# EAGLE design MSXIoT (EAGLE 9.6.2)
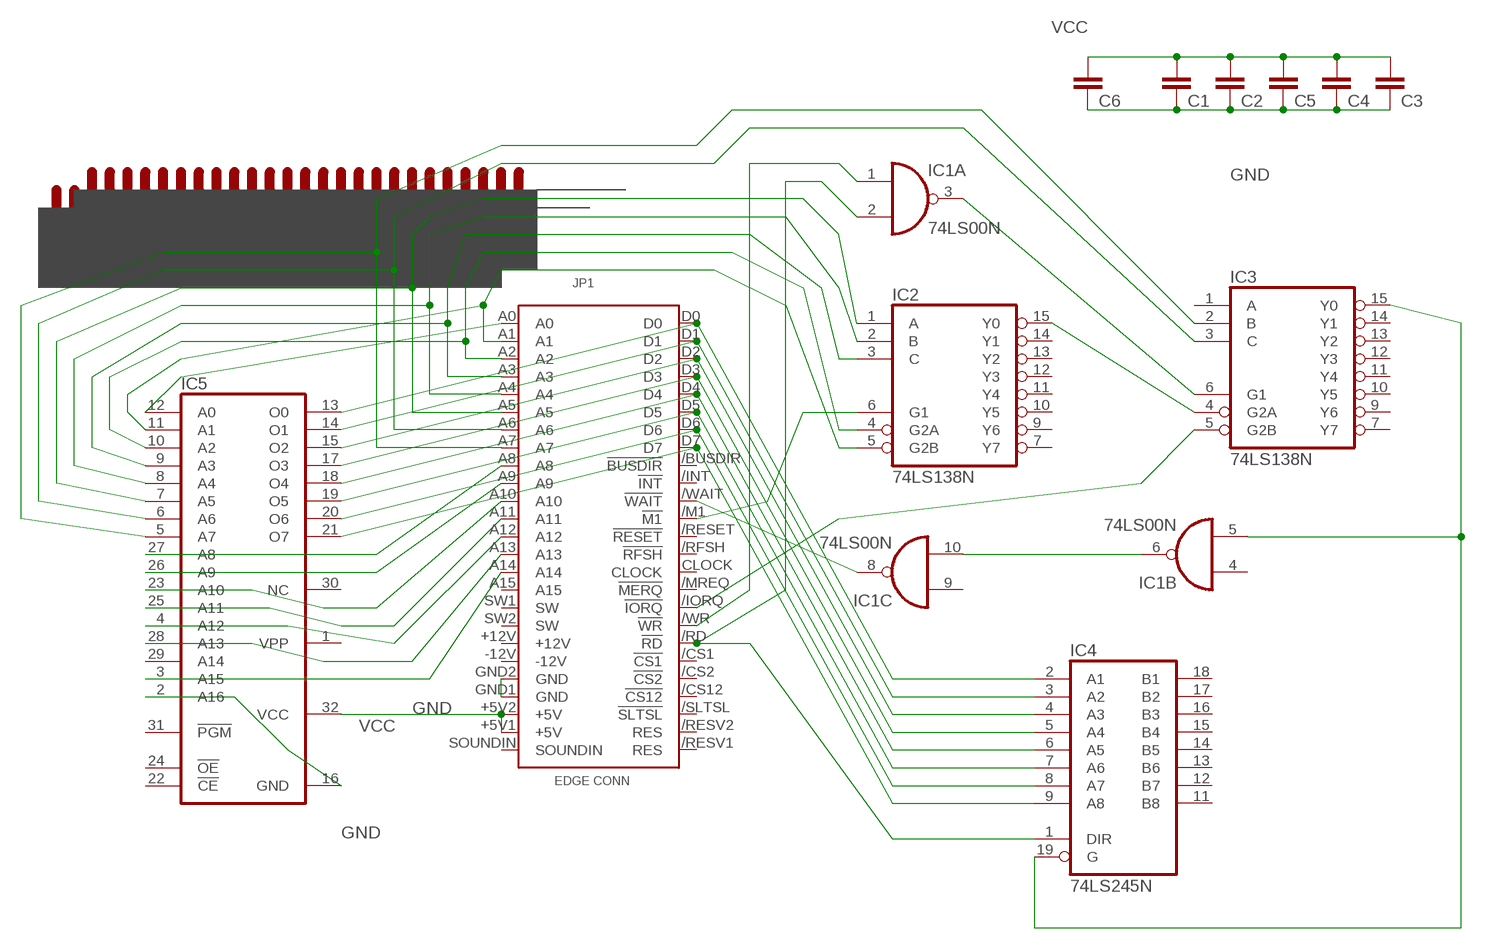
[diagram p0: schematic, sheet 1]

## Parts
C1  C2.5/2  [C2.5-2]
C2  C2,5-3  [C2.5-3]
C3  C2,5-3  [C2.5-3]
C4  C2,5-3  [C2.5-3]
C5  C2,5-3  [C2.5-3]
C6  C2.5/6  [C2.5-6]
IC1  74LS00N  [DIL14]
IC2  74LS138N  [DIL16]
IC3  74LS138N  [DIL16]
IC4  74LS245N  [DIL20]
IC5  27C1001A  [DIL32]
JP1  MSXCART  [MSXCART]

## Nets
GND: C1.2 C2.2 C3.2 C4.2 C5.2 C6.2 IC5.2(A16) IC5.16(GND) JP1.GND1(GND) JP1.GND2(GND)
N$1: IC1.6(B:O) IC1.10(C:I1)
N$2: IC1.8(C:O) JP1./WAIT(!WAIT)
N$3: IC3.5(G2B) JP1./IORQ(!IORQ)
N$4: IC1.5(B:I1) IC3.15(Y0) IC4.19(G)
N$5: IC1.3(A:O) IC3.6(G1)
N$6: IC2.6(G1) JP1./M1(!M1)
N$7: IC2.15(Y0) IC3.4(G2A)
N$8: IC2.5(G2B) IC5.11(A1) JP1.A1
N$9: IC2.4(G2A) IC5.10(A2) JP1.A2
N$10: IC2.3(C) IC5.9(A3) JP1.A3
N$11: IC2.2(B) IC5.8(A4) JP1.A4
N$12: IC2.1(A) IC5.7(A5) JP1.A5
N$13: IC1.1(A:I0) JP1./WR(!WR)
N$14: IC1.2(A:I1) IC4.1(DIR) JP1./RD(!RD)
N$15: IC3.3(C) IC5.6(A6) JP1.A6
N$16: IC3.2(B) IC5.5(A7) JP1.A7
N$20: IC5.12(A0) JP1.A0
N$21: IC4.2(A1) IC5.13(O0) JP1.D0
N$22: IC4.3(A2) IC5.14(O1) JP1.D1
N$23: IC4.4(A3) IC5.15(O2) JP1.D2
N$24: IC4.5(A4) IC5.17(O3) JP1.D3
N$25: IC4.6(A5) IC5.18(O4) JP1.D4
N$26: IC4.7(A6) IC5.19(O5) JP1.D5
N$27: IC4.8(A7) IC5.20(O6) JP1.D6
N$28: IC4.9(A8) IC5.21(O7) JP1.D7
N$29: IC5.27(A8) JP1.A8
N$30: IC5.26(A9) JP1.A9
N$31: IC5.23(A10) JP1.A10
N$32: IC5.25(A11) JP1.A11
N$33: IC5.4(A12) JP1.A12
N$34: IC5.28(A13) JP1.A13
N$35: IC5.3(A15) JP1.A14
VCC: C1.1 C2.1 C3.1 C4.1 C5.1 C6.1 IC5.32(VCC) JP1.+5V1(+5V) JP1.+5V2(+5V)
Unconnected: IC1.4(B:I0) IC1.9(C:I0) IC1.11(D:O) IC1.12(D:I0) IC1.13(D:I1) IC2.7(Y7) IC2.9(Y6) IC2.10(Y5) IC2.11(Y4) IC2.12(Y3) IC2.13(Y2) IC2.14(Y1) IC3.1(A) IC3.7(Y7) IC3.9(Y6) IC3.10(Y5) IC3.11(Y4) IC3.12(Y3) IC3.13(Y2) IC3.14(Y1) IC4.11(B8) IC4.12(B7) IC4.13(B6) IC4.14(B5) IC4.15(B4) IC4.16(B3) IC4.17(B2) IC4.18(B1) IC5.1(VPP) IC5.22(!CE) IC5.24(!OE) IC5.29(A14) IC5.30(NC) IC5.31(!PGM) JP1.+12V JP1.-12V JP1./BUSDIR(!BUSDIR) JP1./CS1(!CS1) JP1./CS2(!CS2) JP1./CS12(!CS12) JP1./INT(!INT) JP1./MREQ(!MERQ) JP1./RESET(!RESET) JP1./RESV1(RES) JP1./RESV2(RES) JP1./RFSH(!RFSH) JP1./SLTSL(!SLTSL) JP1.A15 JP1.CLOCK JP1.SOUNDIN JP1.SW1(SW) JP1.SW2(SW)

## Power pins joined to a net without a drawn wire
GND: IC1.7(P:GND) IC2.8(GND) IC3.8(GND) IC4.10(GND)
VCC: IC1.14(P:VCC) IC2.16(VCC) IC3.16(VCC) IC4.20(VCC)

## Library data of the parts
C1-C6 = capacitor-wima:C: CAPACITOR naming: grid - package width
IC1 = 74xx-eu:74*00: Quad 2-input NAND gate
IC2 IC3 = 74xx-eu:74*138: 3-line to 8-line DECODER/DEMULTIPLEXER
IC4 = 74xx-us:74*245: Octal BUS TRANSCEIVER, 3-state
IC5 = memory-nec:27C1001A: MEMORY; MPN: M27C1001-15F1; OC_FARNELL: 1661756; OC_NEWARK: 78M7615
JP1 = msx-con:MSXCART

## Board
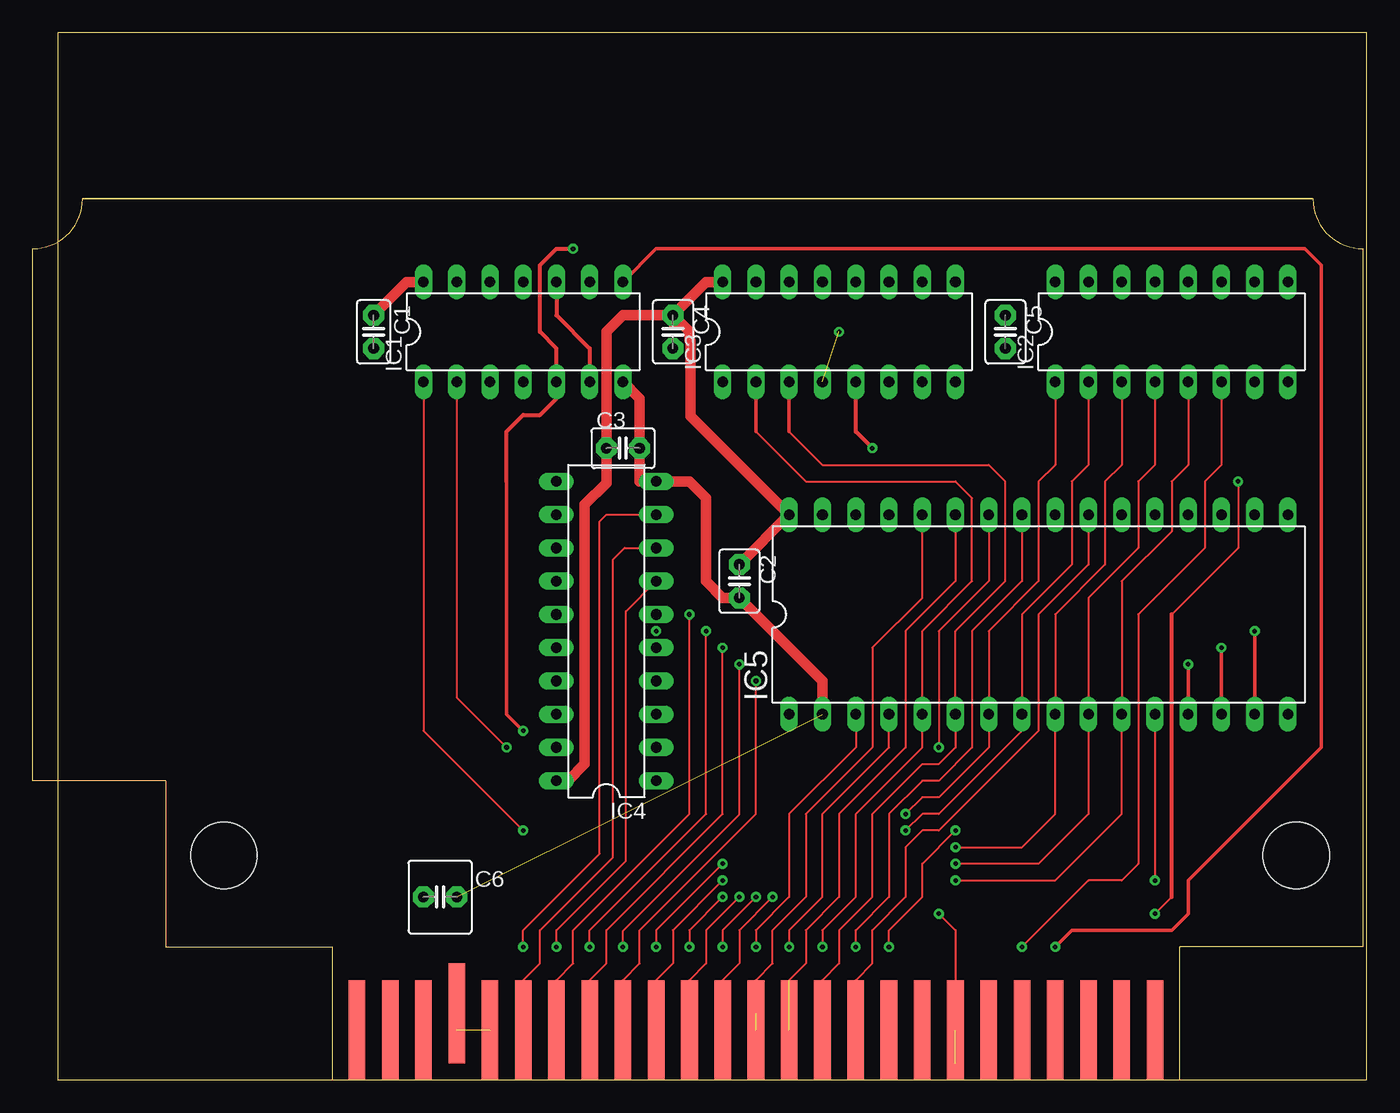
[diagram p1: board, top side]
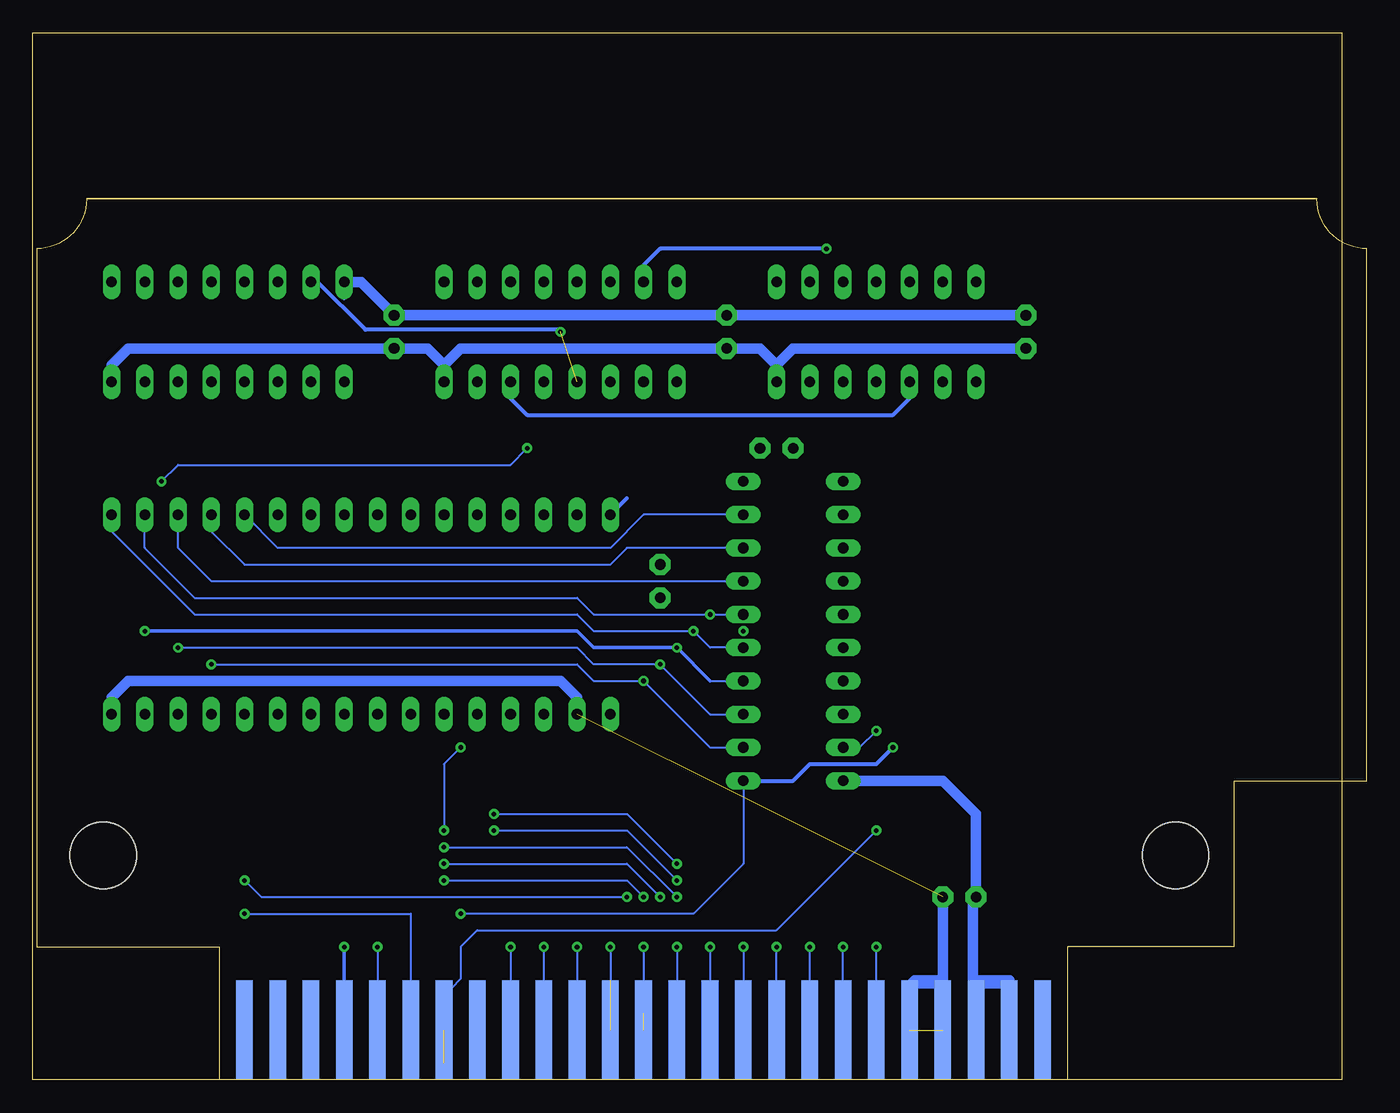
[diagram p2: board, bottom side, seen from below]

Size 100 x 80 mm. Coordinates in mm from the lower left corner, seen from the top.
Outline: 0,0 100,0 100,80 0,80 0,0
Copper layers (1*16): Top 0.035mm / dielectric 1.5mm / Bottom 0.035mm
Design rules "default": minimum track width 6mil, minimum drill 0.35mm, track to track 6mil, track to pad 6mil, pad to pad 6mil, via to via 6mil, smd to smd 6mil, copper to edge 40mil, drill to drill 6mil, minimum pad ring 10mil, minimum via ring 8mil, stop-mask expansion 4mil, vias tented up to drill 0mil, thermal gap 10mil

### Footprints (pad centres in the part's own frame; a part is rotated, then mirrored left to right if it is on the bottom)
C2.5-2 = drill 0.813 pad 1.6 octagon: 1 -1.27,0; 2 1.27,0
C2.5-3 = drill 0.813 pad 1.6 octagon: 1 -1.27,0; 2 1.27,0
C2.5-6 = drill 0.813 pad 1.6 octagon: 1 -1.27,0; 2 1.27,0
DIL14 = drill 0.813 long: 1 -7.62,-3.81; 2 -5.08,-3.81; 3 -2.54,-3.81; 4 0,-3.81; 5 2.54,-3.81; 6 5.08,-3.81; 7 7.62,-3.81; 8 7.62,3.81; 9 5.08,3.81; 10 2.54,3.81; 11 0,3.81; 12 -2.54,3.81; 13 -5.08,3.81; 14 -7.62,3.81
DIL16 = drill 0.813 long: 1 -8.89,-3.81; 2 -6.35,-3.81; 3 -3.81,-3.81; 4 -1.27,-3.81; 5 1.27,-3.81; 6 3.81,-3.81; 7 6.35,-3.81; 8 8.89,-3.81; 9 8.89,3.81; 10 6.35,3.81; 11 3.81,3.81; 12 1.27,3.81; 13 -1.27,3.81; 14 -3.81,3.81; 15 -6.35,3.81; 16 -8.89,3.81
DIL20 = drill 0.813 long: 1 -11.43,-3.81; 2 -8.89,-3.81; 3 -6.35,-3.81; 4 -3.81,-3.81; 5 -1.27,-3.81; 6 1.27,-3.81; 7 3.81,-3.81; 8 6.35,-3.81; 9 8.89,-3.81; 10 11.43,-3.81; 11 11.43,3.81; 12 8.89,3.81; 13 6.35,3.81; 14 3.81,3.81; 15 1.27,3.81; 16 -1.27,3.81; 17 -3.81,3.81; 18 -6.35,3.81; 19 -8.89,3.81; 20 -11.43,3.81
DIL32 = drill 0.813 long: 1 -19.05,-7.62; 2 -16.51,-7.62; 3 -13.97,-7.62; 4 -11.43,-7.62; 5 -8.89,-7.62; 6 -6.35,-7.62; 7 -3.81,-7.62; 8 -1.27,-7.62; 9 1.27,-7.62; 10 3.81,-7.62; 11 6.35,-7.62; 12 8.89,-7.62; 13 11.43,-7.62; 14 13.97,-7.62; 15 16.51,-7.62; 16 19.05,-7.62; 17 19.05,7.62; 18 16.51,7.62; 19 13.97,7.62; 20 11.43,7.62; 21 8.89,7.62; 22 6.35,7.62; 23 3.81,7.62; 24 1.27,7.62; 25 -1.27,7.62; 26 -3.81,7.62; 27 -6.35,7.62; 28 -8.89,7.62; 29 -11.43,7.62; 30 -13.97,7.62; 31 -16.51,7.62; 32 -19.05,7.62
MSXCART = smd 1.27 x 7.62 bottom: +5V1 -24.13,-36.83; +5V2 -21.59,-36.83; /CS1 34.29,-36.83; /CS12 31.75,-36.83; /IORQ 21.59,-36.83; /M1 24.13,-36.83; /RESET 16.51,-36.83; /RESV2 29.21,-36.83; /WAIT 26.67,-36.83; /WR 19.05,-36.83; A1 1.27,-36.83; A3 -1.27,-36.83; A5 -3.81,-36.83; A7 8.89,-36.83; A9 13.97,-36.83; A11 11.43,-36.83; A12 6.35,-36.83; A14 3.81,-36.83; D1 -6.35,-36.83; D3 -8.89,-36.83; D5 -11.43,-36.83; D7 -13.97,-36.83; GND1 -19.05,-36.83; GND2 -16.51,-36.83; SOUNDIN -26.67,-36.83 | smd 1.27 x 7.62: +12V -24.13,-36.83; -12V -26.67,-36.83; /BUSDIR 24.13,-36.83; /CS2 34.29,-36.83; /INT 26.67,-36.83; /MREQ 21.59,-36.83; /RD 19.05,-36.83; /RESV1 16.51,-36.83; /RFSH 29.21,-36.83; /SLTSL 31.75,-36.83; A0 1.27,-36.83; A2 -1.27,-36.83; A4 -3.81,-36.83; A6 8.89,-36.83; A8 6.35,-36.83; A10 11.43,-36.83; A13 3.81,-36.83; A15 13.97,-36.83; CLOCK -16.51,-36.83; D0 -6.35,-36.83; D2 -8.89,-36.83; D4 -11.43,-36.83; D6 -13.97,-36.83; SW1 -19.05,-35.56; SW2 -21.59,-36.83 | hole 5.08: -36.83,-23.495; 45.085,-23.495

### Placement (x,y rotation side)
C1  24.13,57.15 270 top
C2  52.07,38.1 270 top
C3  43.18,48.26 0 top
C4  46.99,57.15 270 top
C5  72.39,57.15 270 top
C6  29.21,13.97 0 top
IC1  35.56,57.15 0 top
IC2  85.09,57.15 0 top
IC3  59.69,57.15 0 top
IC4  41.91,34.29 90 top
IC5  74.93,35.56 0 top
JP1  49.53,40.64 0 top

### Tracks (layer width: path | path; a pad name or v marks a point on that pad's centre or on a via)
GND  (2 unrouted)
  Top 0.813: IC1.7 44.45,52.07 C3.2 44.45,45.72 IC4.10 48.26,45.72 49.53,44.45 49.53,38.1 50.8,36.83 C2.2 58.42,30.48 IC5.2
  Bottom 0.152: IC5.16 93.98,27.29
  Bottom 0.305: 71.12,55.88 C5.2
  Bottom 0.508: JP1.GND1 30.48,6.71
  Bottom 0.813: C6.2 30.48,7.62 32.61,7.62 33.25,6.99 33.25,6.58 33.02,6.35 32.79,6.58 32.79,7.15 32.55,7.39 30.95,7.39 30.71,7.15 30.71,4.04 JP1.GND1 | C1.2 41.91,55.88 43.18,54.61 | IC1.7 43.18,54.61 | 43.18,54.61 44.45,55.88 C4.2 67.31,55.88 68.58,54.61 | IC3.8 68.58,54.61 | 68.58,54.61 69.85,55.88 C5.2 92.71,55.88 93.98,54.61 IC2.8 | IC5.2 58.42,29.21 59.69,30.48 85.09,30.48 92.71,30.48 93.98,29.21 IC5.16
N$1
  Top 0.305: IC1.10 38.1,58.42 40.64,55.88 IC1.6
N$2  (via drill 0.35)
  Top 0.254: IC1.8 45.72,63.5 95.25,63.5 96.52,62.23 96.52,25.4 86.36,15.24 86.36,12.7 85.09,11.43 77.47,11.43 v76.2,10.16
  Bottom 0.254: v76.2,10.16 JP1./WAIT
N$3  (via drill 0.35)
  Top 0.152: 85.09,35.56 90.17,40.64 v90.17,45.72 | v83.82,12.7 85.09,13.97
  Top 0.305: v62.23,48.26 60.96,49.53 IC3.5 | 85.09,13.97 85.09,35.56
  Bottom 0.152: v90.17,45.72 88.9,46.99 63.5,46.99 v62.23,48.26 | v83.82,12.7 71.12,12.7 JP1./IORQ
N$4  (via drill 0.35)
  Top 0.254: v35.56,26.67 34.29,27.94 34.29,45.72
  Top 0.305: 34.29,45.72 34.29,49.53 35.56,50.8 36.83,50.8 38.1,52.07 IC1.5 38.1,55.88 36.83,57.15 36.83,62.23 38.1,63.5 v39.37,63.5
  Bottom 0.152: IC4.19 36.83,25.4 v35.56,26.67
  Bottom 0.305: v39.37,63.5 52.07,63.5 53.34,62.23 IC3.15
N$5
  Bottom 0.305: IC3.6 63.5,52.07 62.23,50.8 34.29,50.8 33.02,52.07 IC1.3
N$6  (via drill 0.35)
  Top 0.152: IC2.6 88.9,46.99 87.63,45.72 87.63,40.64 82.55,35.56 82.55,16.51 81.28,15.24 78.74,15.24 v73.66,10.16
  Bottom 0.152: v73.66,10.16 JP1./M1
N$7  (via drill 0.35)  (1 unrouted)
  Bottom 0.305: IC2.15 78.22,60.96 74.58,57.31 59.85,57.31 v59.69,57.15
N$8  (via drill 0.35)
  Top 0.152: IC2.5 86.36,46.99 85.09,45.72 85.09,41.91 81.28,38.1 IC5.11 81.28,20.32 76.2,15.24 v68.58,15.24 | v53.34,13.97 50.8,11.43 v50.8,10.16
  Bottom 0.152: v68.58,15.24 54.61,15.24 v53.34,13.97 | v50.8,10.16 JP1.A1
N$9  (via drill 0.35)
  Top 0.152: IC2.4 83.82,46.99 82.55,45.72 82.55,40.64 78.74,36.83 IC5.10 78.74,20.32 74.93,16.51 v68.58,16.51 | v52.07,13.97 49.53,11.43 49.53,8.89 48.26,7.62 JP1.A2
  Bottom 0.152: v68.58,16.51 54.61,16.51 v52.07,13.97
N$10  (via drill 0.35)
  Top 0.152: IC2.3 81.28,46.99 80.01,45.72 80.01,39.37 76.2,35.56 IC5.9 76.2,20.32 73.66,17.78 v68.58,17.78 | v50.8,13.97 48.26,11.43 v48.26,10.16
  Bottom 0.152: v68.58,17.78 54.61,17.78 v50.8,13.97 | v48.26,10.16 JP1.A3
N$11  (via drill 0.35)
  Top 0.152: IC2.2 78.74,46.99 77.47,45.72 77.47,39.37 73.66,35.56 IC5.8 73.66,26.67 67.31,20.32 66.04,20.32 v64.77,19.05 | v50.8,15.24 46.99,11.43 46.99,8.89 45.72,7.62 JP1.A4
  Bottom 0.152: v64.77,19.05 54.61,19.05 v50.8,15.24
N$12  (via drill 0.35)
  Top 0.152: IC2.1 76.2,46.99 74.93,45.72 74.93,38.1 71.12,34.29 IC5.7 71.12,25.4 67.31,21.59 66.04,21.59 v64.77,20.32 | v50.8,16.51 45.72,11.43 v45.72,10.16
  Bottom 0.152: v64.77,20.32 54.61,20.32 v50.8,16.51 | v45.72,10.16 JP1.A5
N$13  (via drill 0.35)
  Top 0.152: IC1.1 27.94,26.67 v35.56,19.05
  Bottom 0.152: JP1./WR 68.02,4.37 68.02,7.02 67.31,7.73 67.31,10.16 66.04,11.43 43.18,11.43 v35.56,19.05
N$14  (via drill 0.35)  (1 unrouted)
  Top 0.152: v67.31,12.7 68.58,11.43 68.58,1.27 | IC1.2 30.48,29.21 v34.29,25.4
  Bottom 0.152: IC4.1 45.72,16.51 49.53,12.7 v67.31,12.7
  Bottom 0.305: IC4.1 41.91,22.86 40.64,24.13 35.56,24.13 v34.29,25.4
N$15
  Top 0.152: JP1.A6 58.42,7.62 59.69,8.89 59.69,11.43 62.23,13.97 62.23,20.32 66.04,24.13 67.31,24.13 68.58,25.4 IC5.6 68.58,34.29 72.39,38.1 72.39,45.72 71.12,46.99 58.42,46.99 55.88,49.53
  Top 0.254: IC3.3 55.88,49.53
N$16  (via drill 0.35)
  Top 0.152: v58.42,10.16 58.42,11.43 60.96,13.97 60.96,20.32 66.04,25.4 IC5.5 66.04,34.29 69.85,38.1 69.85,44.45 68.58,45.72 57.15,45.72 53.34,49.53
  Top 0.254: IC3.2 53.34,49.53
  Bottom 0.152: v58.42,10.16 JP1.A7
N$20  (via drill 0.35)
  Top 0.152: IC5.12 v83.82,15.24 | v54.61,13.97 52.07,11.43 52.07,8.89 50.8,7.62 JP1.A0
  Bottom 0.152: v83.82,15.24 82.55,13.97 v54.61,13.97
N$21  (via drill 0.35)
  Top 0.152: JP1.D0 43.18,7.62 44.45,8.89 44.45,11.43 53.34,20.32 v53.34,30.48
  Top 0.254: IC5.13 v86.36,31.75
  Bottom 0.152: IC4.2 48.26,25.4 v53.34,30.48 57.15,30.48 58.42,31.75 v86.36,31.75
N$22  (via drill 0.35)
  Top 0.152: v43.18,10.16 43.18,11.38 52.07,20.27 v52.07,31.75
  Top 0.254: IC5.14 v88.9,33.02
  Bottom 0.152: IC4.3 48.26,27.94 v52.07,31.75 57.15,31.75 58.42,33.02 v88.9,33.02 | JP1.D1 v43.18,10.16
N$23  (via drill 0.35)
  Top 0.152: JP1.D2 40.64,7.62 41.91,8.89 41.91,11.43 50.8,20.32 v50.8,33.02
  Top 0.254: IC5.15 v91.44,34.29
  Bottom 0.152: 48.26,30.48 IC4.4
  Bottom 0.254: v91.44,34.29 58.42,34.29 57.15,33.02 v50.8,33.02 48.26,30.48
  other vias: 91.44,27.94
N$24  (via drill 0.35)
  Top 0.152: v40.64,10.16 40.64,11.43 49.53,20.32 v49.53,34.29
  Bottom 0.152: IC4.5 48.26,33.02 v49.53,34.29 57.15,34.29 58.42,35.56 87.63,35.56 93.98,41.91 IC5.17 | JP1.D3 v40.64,10.16
  other vias: 45.72,34.29
N$25  (via drill 0.35)
  Top 0.152: JP1.D4 38.1,7.62 39.37,8.89 39.37,11.43 48.26,20.32 v48.26,35.56
  Bottom 0.152: IC4.6 v48.26,35.56 57.15,35.56 58.42,36.83 87.63,36.83 91.44,40.64 IC5.18
N$26  (via drill 0.35)
  Top 0.152: v38.1,10.16 38.1,11.43 43.41,16.74 43.41,35.79 IC4.7
  Bottom 0.152: IC5.19 88.9,40.64 86.36,38.1 IC4.7 | JP1.D5 v38.1,10.16
N$27
  Top 0.152: JP1.D6 35.56,7.62 36.83,8.89 36.83,11.43 42.42,17.02 42.42,39.75 43.31,40.64 IC4.8
  Bottom 0.152: IC4.8 54.61,40.64 55.88,39.37 83.82,39.37 86.36,41.91 IC5.20
N$28  (via drill 0.35)
  Top 0.152: v35.56,10.16 35.56,11.43 41.4,17.27 41.4,42.67 41.91,43.18 IC4.9
  Bottom 0.152: IC4.9 53.34,43.18 55.88,40.64 81.28,40.64 IC5.21 | JP1.D7 v35.56,10.16
N$29  (1 unrouted)
  Top 0.152: IC5.27 68.58,38.1 64.77,34.29 64.77,25.4 59.69,20.32 59.69,13.97 57.15,11.43 57.15,8.89 55.88,7.62
N$30  (via drill 0.35)
  Top 0.152: IC5.26 71.12,38.1 67.31,34.29 v67.31,25.4 | v68.58,19.05 66.04,16.51 66.04,13.97 63.5,11.43 v63.5,10.16
  Bottom 0.152: v63.5,10.16 JP1.A9 | v67.31,25.4 68.58,24.13 v68.58,19.05
N$31
  Top 0.152: IC5.23 78.74,39.37 74.93,35.56 74.93,26.67 67.31,19.05 66.04,19.05 64.77,17.78 64.77,13.97 62.23,11.43 62.23,8.89 60.96,7.62 JP1.A10
N$32  (via drill 0.35)
  Top 0.152: IC5.25 73.66,38.1 69.85,34.29 69.85,25.4 67.31,22.86 66.04,22.86 63.5,20.32 63.5,13.97 60.96,11.43 v60.96,10.16
  Bottom 0.152: v60.96,10.16 JP1.A11
N$33  (via drill 0.35)  (1 unrouted)
  Top 0.152: IC5.4 63.5,25.4 58.42,20.32 58.42,13.97 55.88,11.43 v55.88,10.16
  Bottom 0.152: v55.88,10.16 55.88,5.08
N$34
  Top 0.152: IC5.28 66.04,36.83 62.23,33.02 62.23,25.4 57.15,20.32 57.15,13.97 54.61,11.43 54.61,8.89 53.34,7.62 JP1.A13
N$35  (via drill 0.35)  (1 unrouted)
  Top 0.152: IC5.3 60.96,25.4 55.88,20.32 55.88,13.97 53.34,11.43 v53.34,10.16
  Bottom 0.152: v53.34,10.16 53.34,5.08
VCC
  Top 0.813: C1.1 26.67,60.96 IC1.14 | C4.1 49.53,60.96 IC3.16 | 46.99,57.8 C4.1 | C4.1 48.26,57.15 48.26,56.53 48.35,56.44 48.35,50.71 IC5.32 C2.1 | IC4.20 38.99,22.86 40.26,24.13 40.26,43.95 41.91,45.6 C3.1 41.91,57.15 43.18,58.42 C4.1
  Bottom 0.254: 76.2,59.69 IC2.16
  Bottom 0.305: 54.61,44.45 IC5.32
  Bottom 0.61: JP1.+5V1 25.4,6.78
  Bottom 0.813: JP1.+5V1 25.4,7.62 | 25.4,7.62 28.17,7.62 28.17,13.74 C6.1 27.94,20.32 30.48,22.86 IC4.20 | 25.4,7.62 25.63,7.39 27.47,7.39 27.94,6.92 JP1.+5V2 | IC2.16 74.93,60.96 C5.1 C4.1 C1.1